# Altium schematic sheet PIC.SchDoc
size A
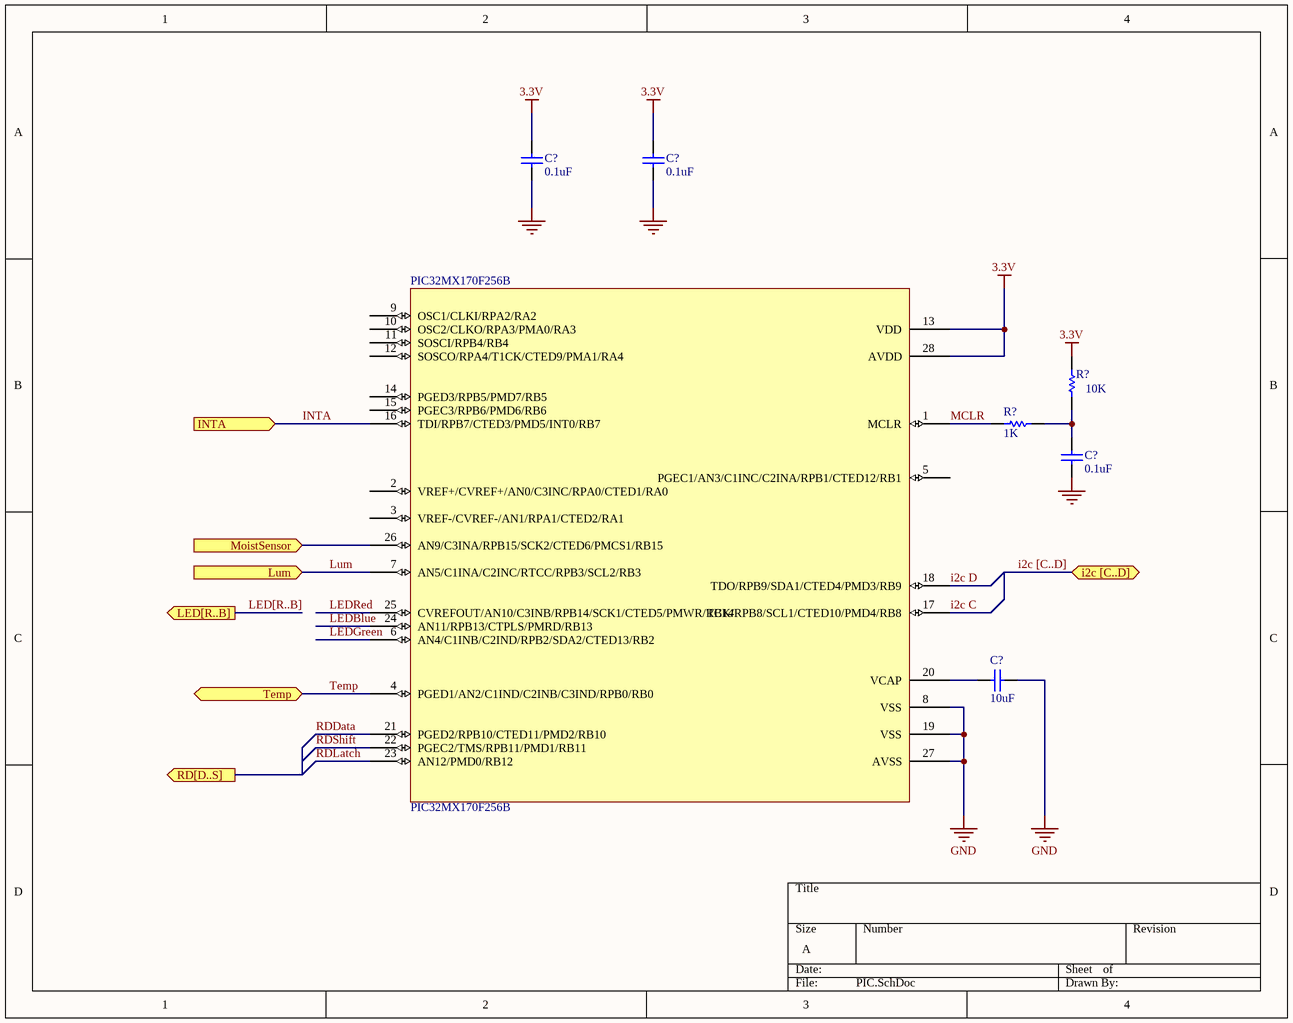
[diagram p0: PIC.SchDoc]

## Parts
(Parts that share a designator on the sheet are numbered #1, #2 ... from top to bottom, then left to right.)
C?#1  0.1uF  [RAD-0.3]
C?#2  0.1uF  [RAD-0.3]
C?#3  0.1uF  [RAD-0.3]
C?#4  10uF  [RAD-0.3]
PIC32MX170F256B  PIC32MX170F256B
R?#1  10K  [AXIAL-0.3]
R?#2  1K  [AXIAL-0.3]

## Ports
i2c [C..D] (bidir), INTA (in), LED[R..B] (out), Lum (in), MoistSensor (in), RD[D..S] (out), Temp (bidir)

## Nets
3.3V: C?#1.2 C?#2.2 PIC32MX170F256B.13(VDD) PIC32MX170F256B.28(AVDD) R?#1.2
GND: C?#1.1 C?#2.1 C?#3.1 C?#4.2 PIC32MX170F256B.8(VSS) PIC32MX170F256B.19(VSS) PIC32MX170F256B.27(AVSS)
i2c C: PIC32MX170F256B.17(TCK/RPB8/SCL1/CTED10/PMD4/RB8)
i2c D: PIC32MX170F256B.18(TDO/RPB9/SDA1/CTED4/PMD3/RB9)
INTA: PIC32MX170F256B.16(TDI/RPB7/CTED3/PMD5/INT0/RB7) ; port INTA
LEDBlue: PIC32MX170F256B.24(AN11/RPB13/CTPLS/PMRD/RB13)
LEDGreen: PIC32MX170F256B.6(AN4/C1INB/C2IND/RPB2/SDA2/CTED13/RB2)
LEDRed: PIC32MX170F256B.25(CVREFOUT/AN10/C3INB/RPB14/SCK1/CTED5/PMWR/RB14)
Lum: PIC32MX170F256B.7(AN5/C1INA/C2INC/RTCC/RPB3/SCL2/RB3) ; port Lum
MCLR: PIC32MX170F256B.1(MCLR) R?#2.2
MoistSensor: PIC32MX170F256B.26(AN9/C3INA/RPB15/SCK2/CTED6/PMCS1/RB15) ; port MoistSensor
RDData: PIC32MX170F256B.21(PGED2/RPB10/CTED11/PMD2/RB10)
RDLatch: PIC32MX170F256B.23(AN12/PMD0/RB12)
RDShift: PIC32MX170F256B.22(PGEC2/TMS/RPB11/PMD1/RB11)
Temp: PIC32MX170F256B.4(PGED1/AN2/C1IND/C2INB/C3IND/RPB0/RB0) ; port Temp
NetC?#3_2: C?#3.2 R?#1.1 R?#2.1
NetC?#4_1: C?#4.1 PIC32MX170F256B.20(VCAP)

Not connected (* = marked no-connect by the designer): PIC32MX170F256B 2(VREF+/CVREF+/AN0/C3INC/RPA0/CTED1/RA0) 3(VREF-/CVREF-/AN1/RPA1/CTED2/RA1) 5(PGEC1/AN3/C1INC/C2INA/RPB1/CTED12/RB1) 9(OSC1/CLKI/RPA2/RA2) 10(OSC2/CLKO/RPA3/PMA0/RA3) 11(SOSCI/RPB4/RB4) 12(SOSCO/RPA4/T1CK/CTED9/PMA1/RA4) 14(PGED3/RPB5/PMD7/RB5) 15(PGEC3/RPB6/PMD6/RB6)

## Buses and harness runs
bus i2c [C..D] = port i2c [C..D]
bus LED[R..B] = port LED[R..B]

## Library data of the parts
C?#1-C?#4 = Cap: Capacitor; Value: 100pF; Published: 8-Jun-2000; LatestRevisionDate: 17-Jul-2002; LatestRevisionNote: Re-released for DXP Platform.; PackageReference: RAD-0.3; Publisher: Altium Limited; PackageDescription: Radial Cap, Thru-Hole; 2 Leads; 0.3 in Pin Spacing
R?#1 = Res1: Resistor; Value: 1K; Published: 8-Jun-2000; LatestRevisionDate: 17-Jul-2002; LatestRevisionNote: Re-released for DXP Platform.; PackageReference: AXIAL-0.3; Publisher: Altium Limited; PackageDescription: Axial Device, Thru-Hole; 2 Leads; 0.3 in Pin Spacing
R?#2 = Res1: Resistor; Published: 8-Jun-2000; LatestRevisionDate: 17-Jul-2002; LatestRevisionNote: Re-released for DXP Platform.; PackageReference: AXIAL-0.3; Publisher: Altium Limited; PackageDescription: Axial Device, Thru-Hole; 2 Leads; 0.3 in Pin Spacing; Value: 1K